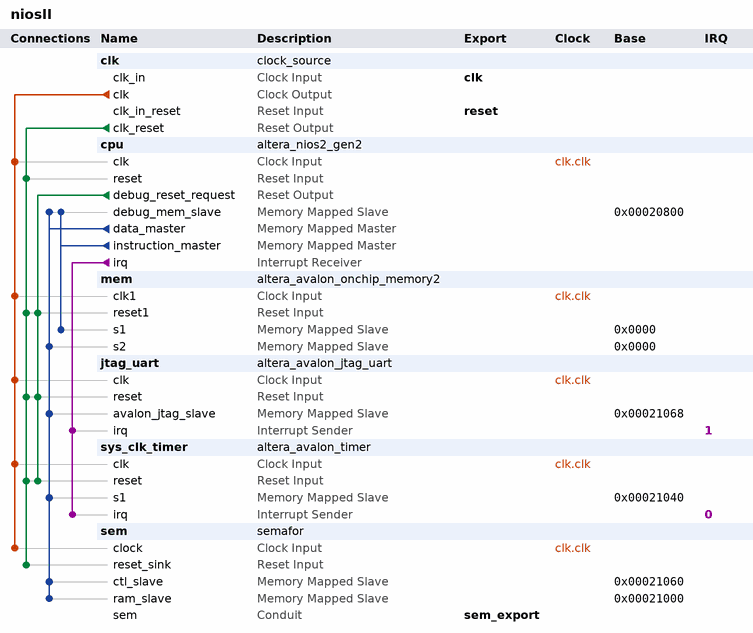
[diagram p0: system contents]
# Platform Designer (Qsys) system niosII, Cyclone IV E EP4CE115F29C7
# Parameters at their usual value, and those the tool derives, are not listed.
package require -exact qsys 18.1
create_system niosII
set_project_property DEVICE_FAMILY {Cyclone IV E}
set_project_property DEVICE EP4CE115F29C7

add_instance clk clock_source 18.1
set_instance_parameter_value clk clockFrequency 50000000

add_instance cpu altera_nios2_gen2 18.1
set_instance_parameter_value cpu dcache_size 2048
set_instance_parameter_value cpu exceptionSlave mem.s1
set_instance_parameter_value cpu icache_size 4096
set_instance_parameter_value cpu impl Tiny
set_instance_parameter_value cpu resetSlave mem.s1

add_instance mem altera_avalon_onchip_memory2 18.1
set_instance_parameter_value mem dataWidth 32
set_instance_parameter_value mem dualPort true
set_instance_parameter_value mem initMemContent true
set_instance_parameter_value mem initializationFileName onchip_mem.hex
set_instance_parameter_value mem memorySize 131072
set_instance_parameter_value mem singleClockOperation true

add_instance jtag_uart altera_avalon_jtag_uart 18.1
set_instance_parameter_value jtag_uart simInteractiveOptions NO_INTERACTIVE_WINDOWS

add_instance sys_clk_timer altera_avalon_timer 18.1
set_instance_parameter_value sys_clk_timer period 1
set_instance_parameter_value sys_clk_timer periodUnits MSEC

add_instance sem semafor 1.0
set_instance_parameter_value sem m 32

# connections
add_connection clk.clk cpu.clk clock
add_connection clk.clk jtag_uart.clk clock
add_connection clk.clk mem.clk1 clock
add_connection clk.clk sem.clock clock
add_connection clk.clk sys_clk_timer.clk clock
add_connection clk.clk_reset cpu.reset reset
add_connection clk.clk_reset jtag_uart.reset reset
add_connection clk.clk_reset mem.reset1 reset
add_connection clk.clk_reset sem.reset_sink reset
add_connection clk.clk_reset sys_clk_timer.reset reset
add_connection cpu.debug_reset_request jtag_uart.reset reset
add_connection cpu.debug_reset_request mem.reset1 reset
add_connection cpu.debug_reset_request sys_clk_timer.reset reset
add_connection cpu.data_master cpu.debug_mem_slave avalon
set_connection_parameter_value cpu.data_master/cpu.debug_mem_slave baseAddress 0x00020800
add_connection cpu.data_master jtag_uart.avalon_jtag_slave avalon
set_connection_parameter_value cpu.data_master/jtag_uart.avalon_jtag_slave baseAddress 0x00021068
add_connection cpu.data_master mem.s2 avalon
set_connection_parameter_value cpu.data_master/mem.s2 baseAddress 0x0000
add_connection cpu.data_master sem.ctl_slave avalon
set_connection_parameter_value cpu.data_master/sem.ctl_slave baseAddress 0x00021060
add_connection cpu.data_master sem.ram_slave avalon
set_connection_parameter_value cpu.data_master/sem.ram_slave baseAddress 0x00021000
add_connection cpu.data_master sys_clk_timer.s1 avalon
set_connection_parameter_value cpu.data_master/sys_clk_timer.s1 baseAddress 0x00021040
add_connection cpu.instruction_master cpu.debug_mem_slave avalon
set_connection_parameter_value cpu.instruction_master/cpu.debug_mem_slave baseAddress 0x00020800
add_connection cpu.instruction_master mem.s1 avalon
set_connection_parameter_value cpu.instruction_master/mem.s1 baseAddress 0x0000
add_connection cpu.irq jtag_uart.irq interrupt
set_connection_parameter_value cpu.irq/jtag_uart.irq irqNumber 1
add_connection cpu.irq sys_clk_timer.irq interrupt
set_connection_parameter_value cpu.irq/sys_clk_timer.irq irqNumber 0

# exported interfaces
add_interface clk clock sink
set_interface_property clk EXPORT_OF clk.clk_in
add_interface reset reset sink
set_interface_property reset EXPORT_OF clk.clk_in_reset
add_interface sem_export conduit end
set_interface_property sem_export EXPORT_OF sem.sem

set_interconnect_requirement {$system} qsys_mm.clockCrossingAdapter HANDSHAKE
set_interconnect_requirement {$system} qsys_mm.enableEccProtection FALSE
set_interconnect_requirement {$system} qsys_mm.insertDefaultSlave FALSE
set_interconnect_requirement {$system} qsys_mm.maxAdditionalLatency 1

save_system niosII.qsys
